# Altium schematic sheet STM32F446RE_board.SchDoc: RP2040 CNC
size C; Author: AM; CompanyName: Expatria Technologies; DrawnBy: A.Marles; Engineer: AM; Organization: Expatria Technolgoies; Address1: Schematic; DocumentNumber: 2; SheetNumber: 2; SheetTotal: 14
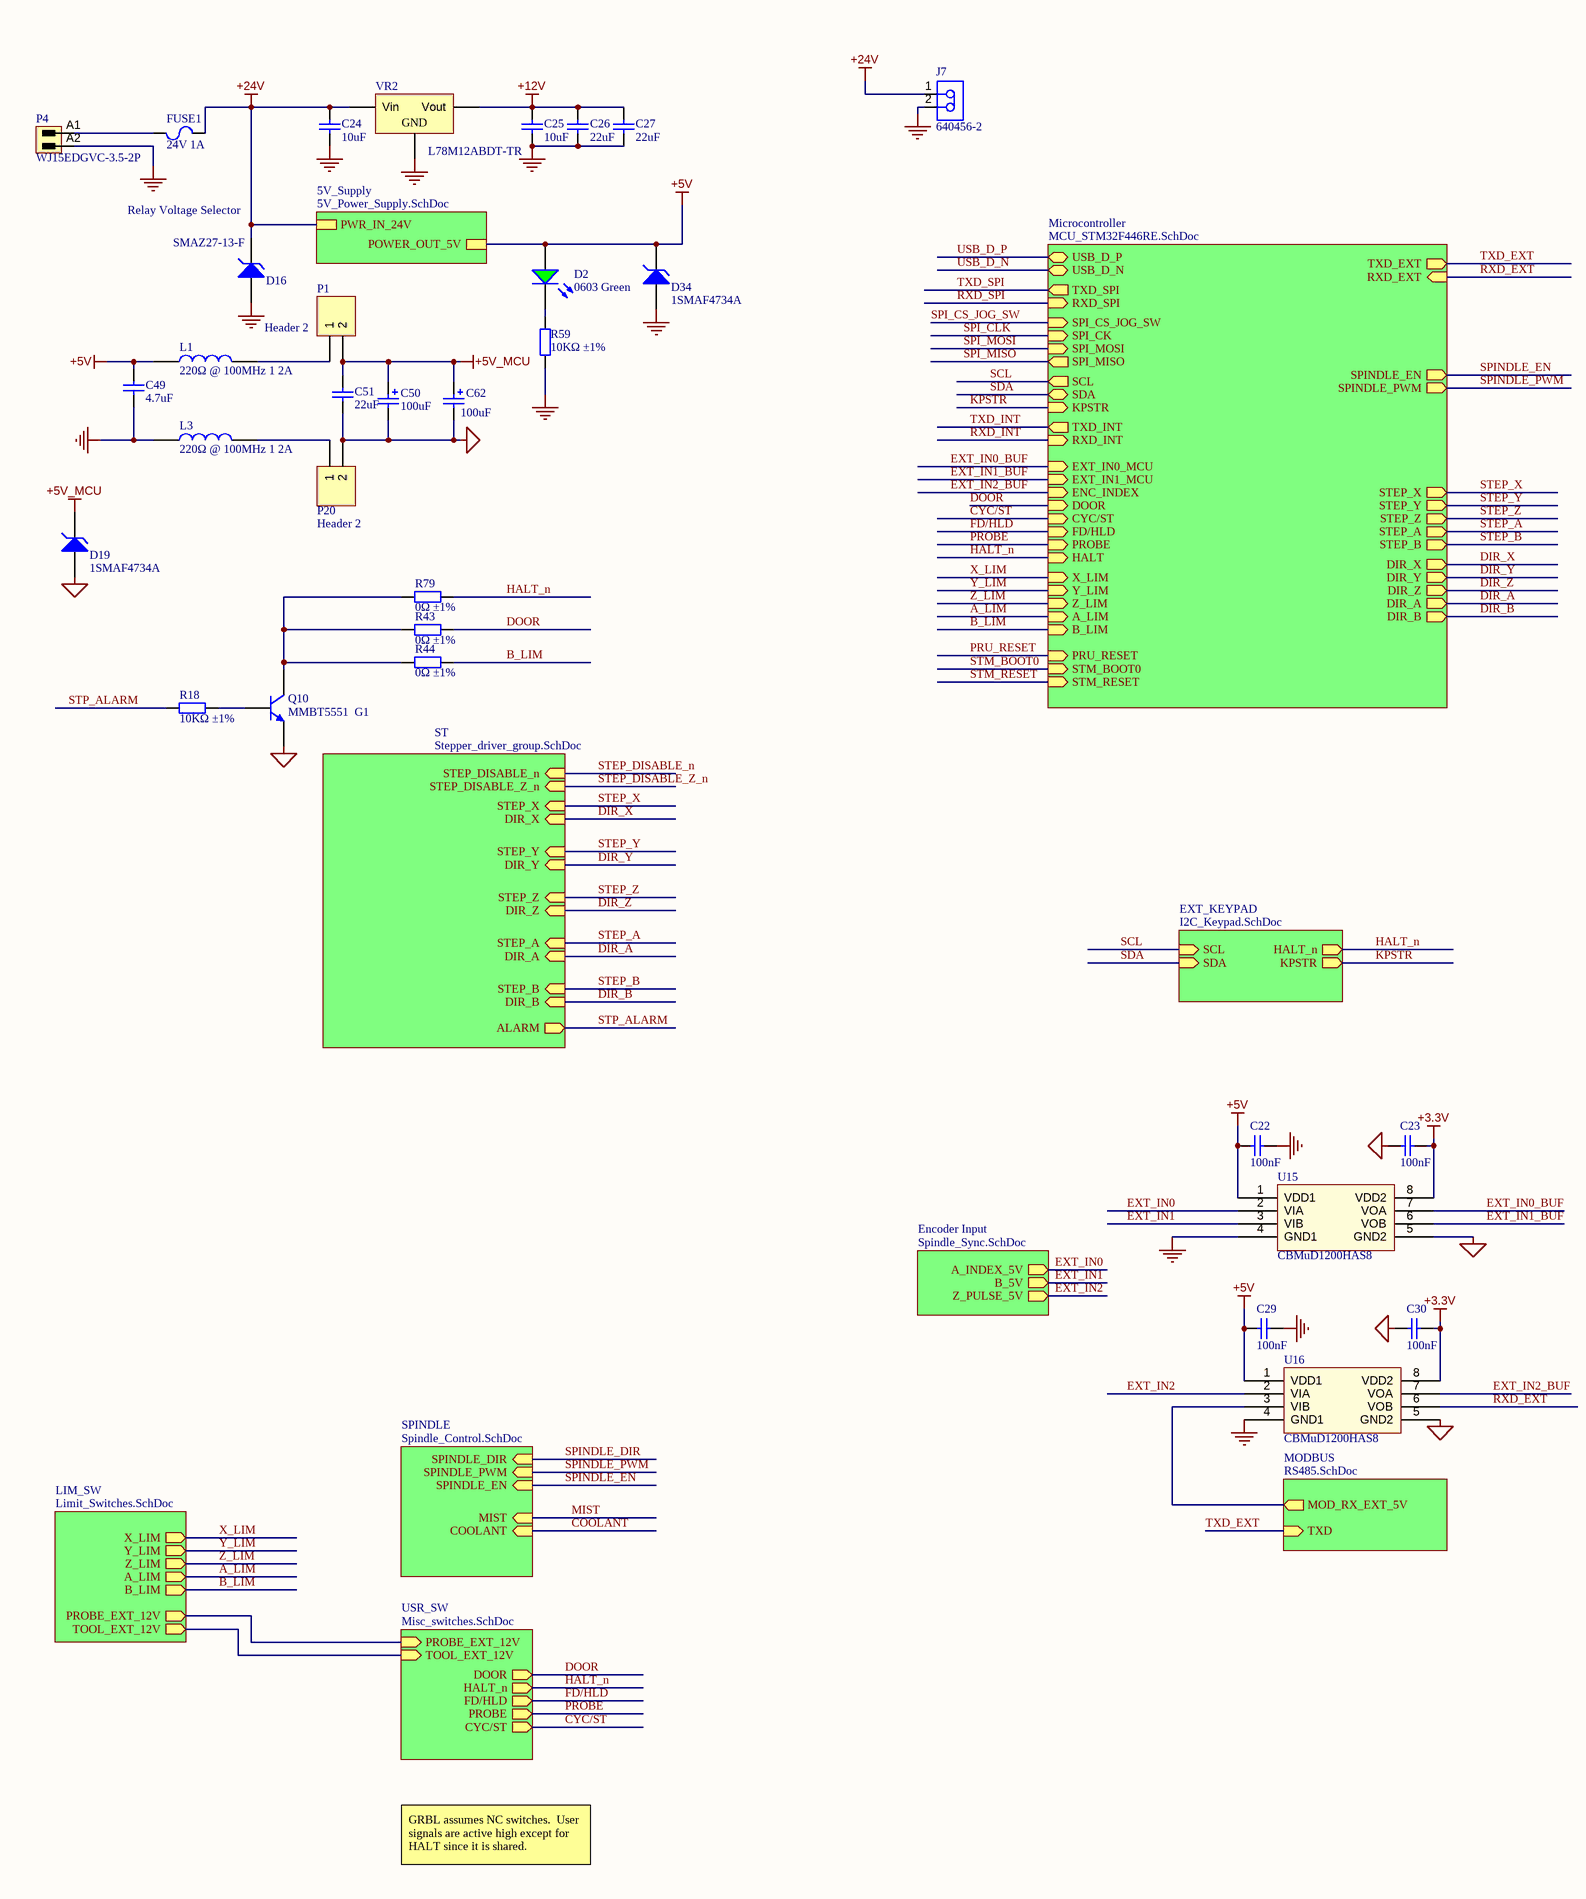
[diagram p0: STM32F446RE_board.SchDoc, left]
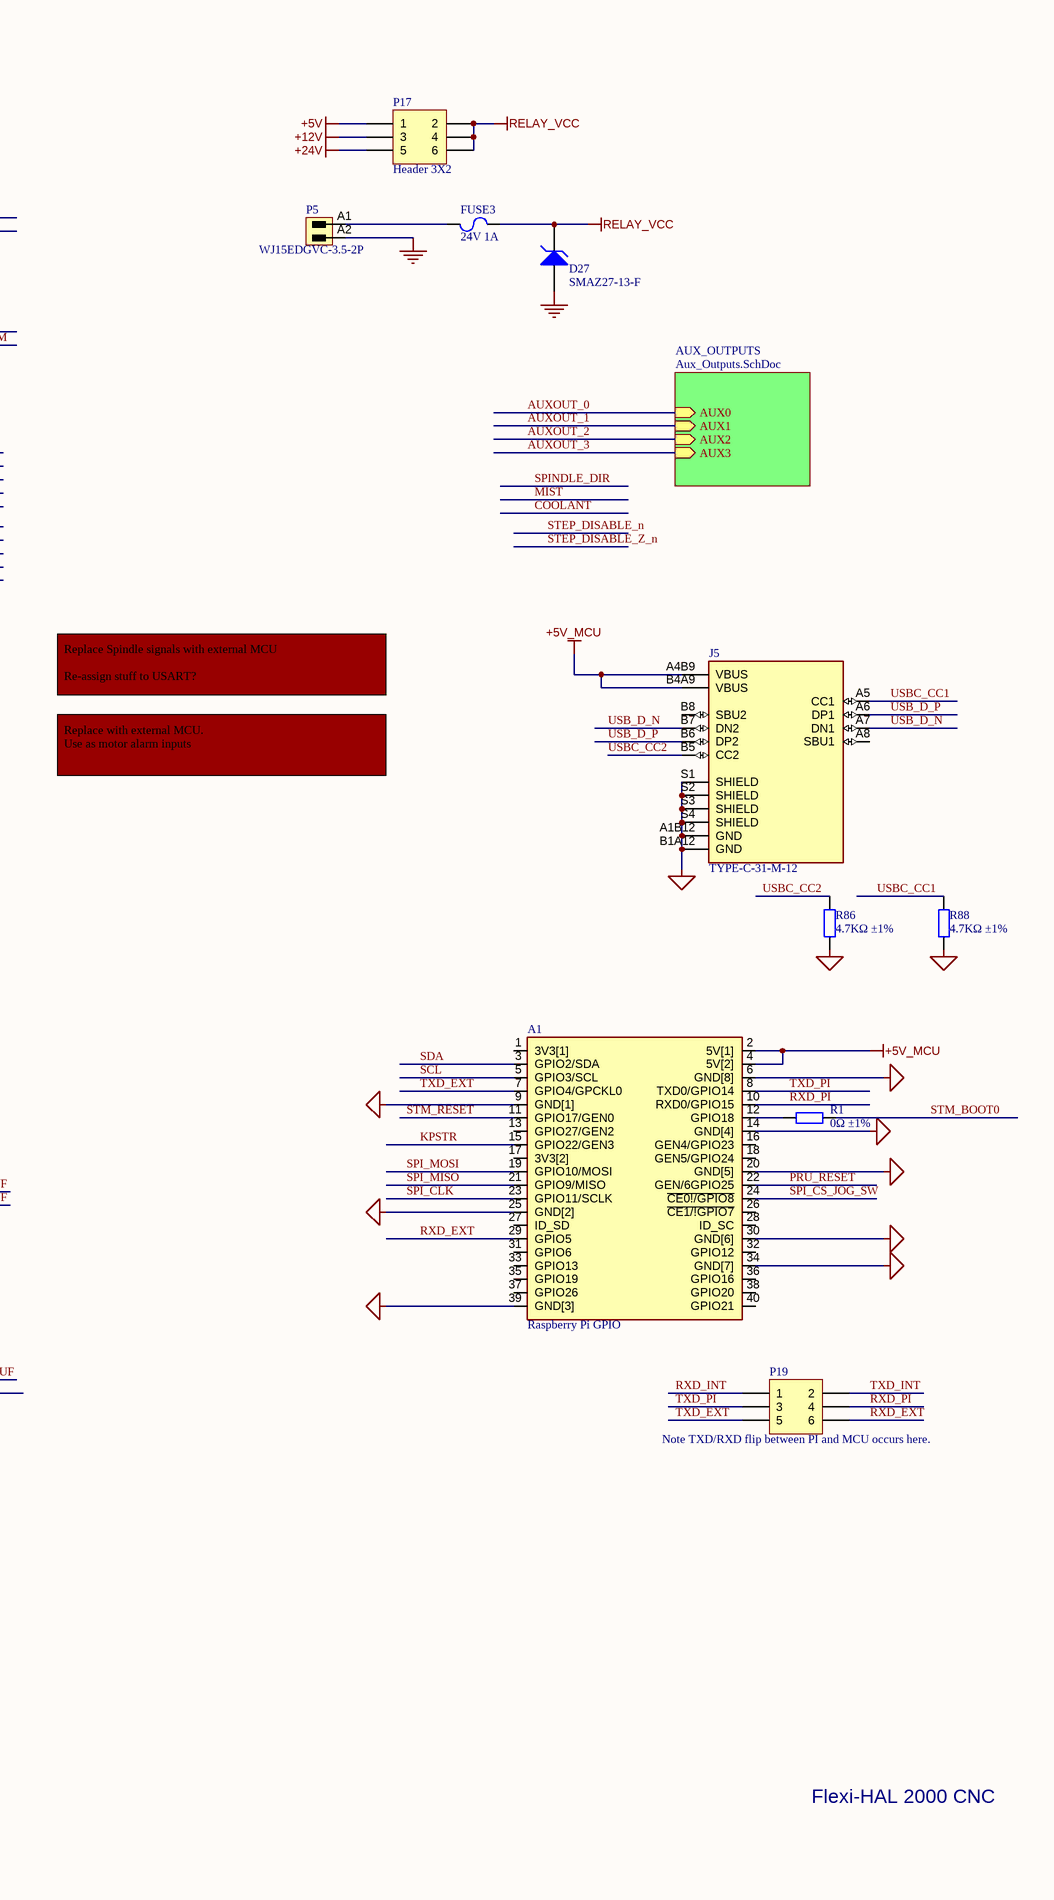
[diagram p1: STM32F446RE_board.SchDoc, right]

## Parts
A1  Raspberry Pi GPIO  [MODULE_RASPBERRY_PI_4_MODEL_B]
C22  100nF  [0603_C]
C23  100nF  [0603_C]
C24  10uF  [1206_C]
C25  10uF  [1206_C]
C26  22uF  [0805_C]
C27  22uF  [0805_C]
C29  100nF  [0603_C]
C30  100nF  [0603_C]
C49  4.7uF  [0603_C]
C50  100uF  [CASE-B_3528]
C51  22uF  [0805_C]
C62  100uF  [WCAP-ASLI_D6.3H7.7]
D2  0603 Green  [0603_LED_S1]
D16  SMAZ27-13-F  [DIOM5226X240N]
D19  1SMAF4734A  [DIOM5226X240N]
D27  SMAZ27-13-F  [DIOM5226X240N]
D34  1SMAF4734A  [DIOM5226X240N]
FUSE1  24V 1A  [1206_C]
FUSE3  24V 1A  [1206_C]
J5  TYPE-C-31-M-12  [HRO_TYPE-C-31-M-12]
J7  640456-2  [TECO-640456-2_V]
L1  220Ω @ 100MHz 1 2A  [0805_C]
L3  220Ω @ 100MHz 1 2A  [0805_C]
P1  Header 2  [HDR1X2]
P4  WJ15EDGVC-3.5-2P  [691321100002]
P5  WJ15EDGVC-3.5-2P  [691321100002]
P17  Header 3X2  [HDR2X3]
P19  Header 3X2  [HDR2X3]  (value not drawn)
P20  Header 2  [HDR1X2]
Q10  MMBT5551  G1  [SOT-23(SOT-23-3)]
R1  0Ω ±1%  [0603_R]
R18  10KΩ ±1%  [0603_R]
R43  0Ω ±1%  [0603_R]
R44  0Ω ±1%  [0603_R]
R59  10KΩ ±1%  [0603_R]
R79  0Ω ±1%  [0603_R]
R86  4.7KΩ ±1%  [0603_R]
R88  4.7KΩ ±1%  [0603_R]
U15  CBMuD1200HAS8  [SOIC-8_150mil]
U16  CBMuD1200HAS8  [SOIC-8_150mil]
VR2  L78M12ABDT-TR  [TO-252-2-180]

## Sub-sheets
5V_Supply = 5V_Power_Supply.SchDoc: POWER_OUT_5V, PWR_IN_24V
AUX_OUTPUTS = Aux_Outputs.SchDoc: AUX3 (in), AUX0 (in), AUX1 (in), AUX2 (in)
Encoder Input = Spindle_Sync.SchDoc: A_INDEX_5V (out), Z_PULSE_5V (out), B_5V (out)
EXT_KEYPAD = I2C_Keypad.SchDoc: HALT_n (out), SCL (in), KPSTR (out), SDA (in)
LIM_SW = Limit_Switches.SchDoc: Y_LIM (out), Z_LIM (out), X_LIM (out), A_LIM (out), B_LIM (out), PROBE_EXT_12V (out), TOOL_EXT_12V (out)
Microcontroller = MCU_STM32F446RE.SchDoc: USB_D_P (bidir), DIR_B (out), EXT_IN1_MCU (in), RXD_INT (in), DIR_Y (out), EXT_IN0_MCU (in), USB_D_N (bidir), DIR_X (out), STEP_B (out), TXD_INT (out), STEP_A (out), SPI_CK (in), SPINDLE_PWM (out), STEP_Z (out), STEP_Y (out), SPI_MISO (out), SPI_MOSI (in), FD/HLD (in), STEP_X (out), CYC/ST (in), SPI_CS_JOG_SW (in), PROBE (in), TXD_EXT (out), SDA (bidir), A_LIM (in), SCL (out), DIR_Z (out), KPSTR (in), RXD_EXT (in), SPINDLE_EN (out), HALT (in), DIR_A (out), PRU_RESET (in), X_LIM (in), Z_LIM (in), STM_BOOT0 (in), Y_LIM (in), B_LIM (in), DOOR (in), STM_RESET (in), TXD_SPI (out), ENC_INDEX (in), RXD_SPI (in)
MODBUS = RS485.SchDoc: TXD (in), MOD_RX_EXT_5V (out)
SPINDLE = Spindle_Control.SchDoc: SPINDLE_EN (in), SPINDLE_DIR (in), SPINDLE_PWM (in), COOLANT (in), MIST (in)
ST = Stepper_driver_group.SchDoc: STEP_Z (in), DIR_Z (in), STEP_X (in), STEP_B (in), DIR_X (in), DIR_A (in), DIR_Y (in), STEP_Y (in), DIR_B (in), STEP_A (in), ALARM (out), STEP_DISABLE_n (in), STEP_DISABLE_Z_n (in)
USR_SW = Misc_switches.SchDoc: FD/HLD (out), PROBE (out), CYC/ST (out), HALT_n (out), DOOR (out), PROBE_EXT_12V (in), TOOL_EXT_12V (in)

## Nets
+3.3V: C23.2 C30.2 U15.8(VDD2) U16.8(VDD2)
+5V: C22.1 C29.1 C49.2 D2.A D34.2(K) L1.1 P17.1 U15.1(VDD1) U16.1(VDD1) ; sheet 5V_Supply/POWER_OUT_5V
+5V_MCU: A1.2(5V[1]) A1.4(5V[2]) C50.1 C51.2 C62.1(P) D19.2(K) J5.A4B9(VBUS) J5.B4A9(VBUS) P1.2
+12V: C25.2 C26.2 C27.2 P17.3 VR2.3(Vout)
+24V: C24.2 D16.2(K) FUSE1.2 J7.1 P17.5 VR2.1(Vin) ; sheet 5V_Supply/PWR_IN_24V
GND: C22.2 C24.1 C25.1 C26.1 C27.1 C29.2 C49.1 D16.1(A) D27.1(A) D34.1(A) J7.2 L3.1 P4.A2 P5.A2 R59.1 U15.4(GND1) U16.4(GND1) VR2.2(GND)
MCU_GND: A1.6(GND[8]) A1.9(GND[1]) A1.14(GND[4]) A1.20(GND[5]) A1.25(GND[2]) A1.30(GND[6]) A1.34(GND[7]) A1.39(GND[3]) C23.1 C30.1 C50.2 C51.1 C62.2(N) D19.1(A) J5.A1B12(GND) J5.B1A12(GND) J5.S1(SHIELD) J5.S2(SHIELD) J5.S3(SHIELD) J5.S4(SHIELD) P20.2 Q10.2(E) R86.2 R88.2 U15.5(GND2) U16.5(GND2)
RELAY_VCC: D27.2(K) FUSE3.2 P17.2 P17.4 P17.6
A_LIM: sheet LIM_SW/A_LIM, sheet Microcontroller/A_LIM
AUXOUT_0: sheet AUX_OUTPUTS/AUX0
AUXOUT_1: sheet AUX_OUTPUTS/AUX1
AUXOUT_2: sheet AUX_OUTPUTS/AUX2
AUXOUT_3: sheet AUX_OUTPUTS/AUX3
B_LIM: R44.1 ; sheet LIM_SW/B_LIM, sheet Microcontroller/B_LIM
COOLANT: sheet SPINDLE/COOLANT
CYC/ST: sheet USR_SW/CYC/ST, sheet Microcontroller/CYC/ST
DIR_A: sheet ST/DIR_A, sheet Microcontroller/DIR_A
DIR_B: sheet ST/DIR_B, sheet Microcontroller/DIR_B
DIR_X: sheet ST/DIR_X, sheet Microcontroller/DIR_X
DIR_Y: sheet ST/DIR_Y, sheet Microcontroller/DIR_Y
DIR_Z: sheet ST/DIR_Z, sheet Microcontroller/DIR_Z
DOOR: R43.1 ; sheet USR_SW/DOOR, sheet Microcontroller/DOOR
EXT_IN0: U15.2(VIA) ; sheet Encoder Input/A_INDEX_5V
EXT_IN0_BUF: U15.7(VOA) ; sheet Microcontroller/EXT_IN0_MCU
EXT_IN1: U15.3(VIB) ; sheet Encoder Input/B_5V
EXT_IN1_BUF: U15.6(VOB) ; sheet Microcontroller/EXT_IN1_MCU
EXT_IN2: U16.2(VIA) ; sheet Encoder Input/Z_PULSE_5V
EXT_IN2_BUF: U16.7(VOA) ; sheet Microcontroller/ENC_INDEX
FD/HLD: sheet USR_SW/FD/HLD, sheet Microcontroller/FD/HLD
HALT_n: R79.1 ; sheet USR_SW/HALT_n, sheet EXT_KEYPAD/HALT_n, sheet Microcontroller/HALT
KPSTR: A1.15(GPIO22/GEN3) ; sheet EXT_KEYPAD/KPSTR, sheet Microcontroller/KPSTR
MIST: sheet SPINDLE/MIST
PROBE: sheet USR_SW/PROBE, sheet Microcontroller/PROBE
PRU_RESET: A1.22(GEN/6GPIO25) ; sheet Microcontroller/PRU_RESET
RXD_EXT: A1.29(GPIO5) P19.6 U16.6(VOB) ; sheet Microcontroller/RXD_EXT
RXD_INT: P19.1 ; sheet Microcontroller/RXD_INT
RXD_PI: A1.10(RXD0/GPIO15) P19.4
RXD_SPI: sheet Microcontroller/RXD_SPI
SCL: A1.5(GPIO3/SCL) ; sheet EXT_KEYPAD/SCL, sheet Microcontroller/SCL
SDA: A1.3(GPIO2/SDA) ; sheet EXT_KEYPAD/SDA, sheet Microcontroller/SDA
SPI_CLK: A1.23(GPIO11/SCLK) ; sheet Microcontroller/SPI_CK
SPI_CS_JOG_SW: A1.24(~{CE0!/GPIO8}) ; sheet Microcontroller/SPI_CS_JOG_SW
SPI_MISO: A1.21(GPIO9/MISO) ; sheet Microcontroller/SPI_MISO
SPI_MOSI: A1.19(GPIO10/MOSI) ; sheet Microcontroller/SPI_MOSI
SPINDLE_DIR: sheet SPINDLE/SPINDLE_DIR
SPINDLE_EN: sheet SPINDLE/SPINDLE_EN, sheet Microcontroller/SPINDLE_EN
SPINDLE_PWM: sheet SPINDLE/SPINDLE_PWM, sheet Microcontroller/SPINDLE_PWM
STEP_A: sheet ST/STEP_A, sheet Microcontroller/STEP_A
STEP_B: sheet ST/STEP_B, sheet Microcontroller/STEP_B
STEP_DISABLE_n: sheet ST/STEP_DISABLE_n
STEP_DISABLE_Z_n: sheet ST/STEP_DISABLE_Z_n
STEP_X: sheet ST/STEP_X, sheet Microcontroller/STEP_X
STEP_Y: sheet ST/STEP_Y, sheet Microcontroller/STEP_Y
STEP_Z: sheet ST/STEP_Z, sheet Microcontroller/STEP_Z
STM_BOOT0: R1.1 ; sheet Microcontroller/STM_BOOT0
STM_RESET: A1.11(GPIO17/GEN0) ; sheet Microcontroller/STM_RESET
STP_ALARM: R18.2 ; sheet ST/ALARM
TXD_EXT: A1.7(GPIO4/GPCKL0) P19.5 ; sheet MODBUS/TXD, sheet Microcontroller/TXD_EXT
TXD_INT: P19.2 ; sheet Microcontroller/TXD_INT
TXD_PI: A1.8(TXD0/GPIO14) P19.3
TXD_SPI: sheet Microcontroller/TXD_SPI
USB_D_N: J5.A7(DN1) J5.B7(DN2) ; sheet Microcontroller/USB_D_N
USB_D_P: J5.A6(DP1) J5.B6(DP2) ; sheet Microcontroller/USB_D_P
USBC_CC1: J5.A5(CC1) R88.1
USBC_CC2: J5.B5(CC2) R86.1
X_LIM: sheet LIM_SW/X_LIM, sheet Microcontroller/X_LIM
Y_LIM: sheet LIM_SW/Y_LIM, sheet Microcontroller/Y_LIM
Z_LIM: sheet LIM_SW/Z_LIM, sheet Microcontroller/Z_LIM
NetA1_12: A1.12(GPIO18) R1.2
NetD2_K: D2.K R59.2
NetFUSE1_1: FUSE1.1 P4.A1
NetFUSE3_1: FUSE3.1 P5.A1
NetL1_2: L1.2 P1.1
NetL3_2: L3.2 P20.1
NetQ10_1: Q10.1(B) R18.1
NetQ10_3: Q10.3(C) R43.2 R44.2 R79.2
NetU16_3: U16.3(VIB) ; sheet MODBUS/MOD_RX_EXT_5V
(unnamed): sheet LIM_SW/PROBE_EXT_12V, sheet USR_SW/PROBE_EXT_12V
(unnamed): sheet LIM_SW/TOOL_EXT_12V, sheet USR_SW/TOOL_EXT_12V

Not connected (* = marked no-connect by the designer): A1 1(3V3[1]) 13(GPIO27/GEN2) 16(GEN4/GPIO23) 17(3V3[2]) 18(GEN5/GPIO24) 26(~{CE1/!GPIO7}) 27(ID_SD) 28(ID_SC) 31(GPIO6) 32(GPIO12) 33(GPIO13) 35(GPIO19) 36(GPIO16) 37(GPIO26) 38(GPIO20) 40(GPIO21); J5 A8(SBU1) B8(SBU2)

## Notes on the sheet
- Relay Voltage Selector
- Replace Spindle signals with external MCU
  Re-assign stuff to USART?
- Replace with external MCU.
  Use as motor alarm inputs
- (near P19) Note TXD/RXD flip between PI and MCU occurs here.
- Flexi-HAL 2000 CNC
- GRBL assumes NC switches.  User signals are active high except for HALT since it is shared.
- Expatria Technologies
- SHEET
- PROJECT
- REV
- 1136 Glade Court
- Port Coquitlam, BC V3B 1R5
- EMAIL: INFO@EXPATRIA.CA
- SIZE
- ENGR
- C
- MODIFIED
- DOCUMENT
- /
- Copyright Expatria Technologies 2022. This document describes Open Hardware and is licensed under the CERN-OHL-S v2. No warranty is implied or expressed.

## Library data of the parts
A1 = ADA3708: Raspberry Pi Zero WH _Zero W with Headers_; MP: DS1023-2*20SF11; MF: CONNFLY Elec; Availability: Unavailable; Package: None; Value: *; Price: None; SuppliersPartNumber: C132132
C22 C23 C29 C30 = 0603 100nF (104) 10% 50V: Chip capacitors; Manufacturer: YAGEO; PartNumber: CC0603KRX7R9BB104; Tolerance: 10%; Voltage: 50V; ComponentLink1Description: Supplier link; ComponentLink1URL: http://www.szlcsc.com/product/details_15331.html; Package: 0603; Supplier: LC; SuppliersPartNumber: C14663; Capacitance: 100nF
C24 C25 = 1206 10uF (106) 10% 50V: Chip capacitors; Manufacturer: Samsung Electro-Mechanics; PartNumber: CL31A106KBHNNNE; Tolerance: 10%; Voltage: 50V; ComponentLink1Description: Supplier link; ComponentLink1URL: http://www.szlcsc.com/product/details_14236.html; Package: 1206; Supplier: LC; SuppliersPartNumber: C13585; Capacitance: 10uF
C26 C27 C51 = 0805 22uF (226) 20% 25V: Chip capacitors; Manufacturer: Samsung Electro-Mechanics; PartNumber: CL21A226MAQNNNE; Tolerance: 20%; Voltage: 25V; ComponentLink1Description: Supplier link; ComponentLink1URL: http://www.szlcsc.com/product/details_46786.html; Package: 0805; Supplier: LC; SuppliersPartNumber: C2922481; Capacitance: 22uF
C49 = 0603 4.7uF (475) 10% 16V: Chip capacitors; Manufacturer: Samsung Electro-Mechanics; PartNumber: CL10A475KO8NNNC; Tolerance: 10%; Voltage: 16V; ComponentLink1Description: Supplier link; ComponentLink1URL: http://www.szlcsc.com/product/details_20375.html; Package: 0603; Supplier: LC; SuppliersPartNumber: C19666; Capacitance: 4.7uF
C50 = 3528 100uF (107) 10% 6.3V: Tantalum capacitor; Manufacturer: AVX; PartNumber: TAJB107K006RNJ; Tolerance: 10%; Voltage: 6.3V; ComponentLink1Description: Supplier link; ComponentLink1URL: http://www.szlcsc.com/product/details_16815.html; Package: 3528; Supplier: LC; SuppliersPartNumber: C16133; Capacitance: 100uF
C62 = 865080445010: -45℃~+105℃ 2000hrs@105℃ 100uF 7.7mm 35V 6.3mm ±20% SMD,6.3x7.7mm Aluminum Electrolytic Capacitors - SMD ROHS; Manufacturer: Capxon International Elec; SuppliersPartNumber: C59934; Value: 100uF
D2 = 0603 LED Green: LED; ComponentLink1Description: 供应商链接; ComponentLink1URL: http://www.szlcsc.com/product/details_73152.html; Package: 0603; Supplier: LC; SuppliersPartNumber: C72043; Color: Green
D16 D19 D27 D34 = BZT52C27: 27V ±5% 1W 500nA @ 20.5V SMA(DO-214AC) Zener Diodes RoHS; ComponentLink1Description: 供应商链接; ComponentLink1URL: http://www.szlcsc.com/product/details_8541.html; Supplier: LC
  D16 D27: Package: SMA(DO-214AC); SuppliersPartNumber: C155318
  D19 D34: Package: SMAF; SuppliersPartNumber: C169539
FUSE1 FUSE3 = JK-nSMD050-24: 24V 1A 0.1s 1206 PTC Resettable Fuses RoHS; Manufacturer: Jinrui Electronic Materials Co.; Package: 1206; Supplier: LC; SuppliersPartNumber: C369160; PartNumber: JK-nSMD050-24
J5 = TYPE-C-31-M-12: USB Connectors 24 Receptacle 1 8.94*7.3mm RoHS; MF: HRO Electronics Co., Ltd.; Value: *; SnapEDA_Link: https://www.snapeda.com/parts/TYPE-C-31-M-12/HRO%20Electronics%20Co.,%20Ltd./view-part/3228496/?ref=snap; Package: Package; MP: TYPE-C-31-M-12; Price: None; Availability: Unavailable; SuppliersPartNumber: C2765186
J7 = CMP-2000-05417-1: Male Header, Pitch 2.54 mm, 1 x 2 Position, Height 10.49 mm, Tail Length 3.556 mm, -55 to 105 degC, RoHS, Bulk; Manufacturer: TE Connectivity; Standards: RoHSCompliant,ELVCompliant,UL94V-0; Material, Housing: Polyester; Agency Approvals: CSA,UL; Brand/Series: MTA-100Series; Contact Centerline Spacing: 0.100 / in.; Material, Contact: CopperAlloy; Current, Rating: 5 / A; Color, Housing: White; Contact Termination Area Plating: Tin; Special Features: Pinstrip; Number of Positions: 2; Pin Spacing: 0.1 / "; Temperature, Operating: -55to+105 / degC; Angle: Straight; Mount Angle: Vertical; Connector Type: MTA-100; Primary Type: InterconnectSystem; Voltage, Rating: 250 / V; Mounting Hole Size: 0.04 / "; Number of Rows: 1; Termination: Solder; Length, Terminal Post: 0.14 / in.; Manufacturer URL: http://www.te.com/; Color: White; Size, Post: 0.025 / in.; Contact Shape: Square; Mounting Type: PCMount; Datasheet URL: https://datasheet.ciiva.com/11746/0900766b80eb7fdd-11746365.pdf; Type: PCBPlug; Datasheet Version: Rev. W, 06/2004; Number of Contacts: 2; Flammability Rating: UL94V-0; Contact Plating: Tin; Length, Pin: 0.14 / "; Contact Mating Area Plating: Tin; Length, Overall: 0.2 / "; SuppliersPartNumber: C86502
L1 L3 = 0402 220R@100Mhz 0.1A: 220Ω @ 100MHz 1 2A 150mΩ 0805 Ferrite Beads ROHS; Notepad: *; Package: 0805; Supplier: LC; SuppliersPartNumber: C139188
P1 P20 = Header 2: Header, 2-Pin; Publisher: Altium Limited; LatestRevisionDate: 17-Jul-2002; LatestRevisionNote: Re-released for DXP Platform.; SuppliersPartNumber: C234182
P4 = 3.5mm Terminal Header 2p: Header,Male Pin,Covered(4 Sided) 2 1 0.138"（3.50mm） 2 P=3.5mm Pluggable System Terminal Block RoHS; UL_94_flammability_rating: V-0; Pitch_mm: 3.5 mm; ComponentLink1Description: Manufacturer URL; ComponentLink1URL: http://www.weidmueller.com/; Revision: V1; SuppliersPartNumber: C192777; Supplier: LCSC
P5 = 3.5mm Terminal Header 2p: Header,Male Pin,Covered(4 Sided) 2 1 0.138"（3.50mm） 2 P=3.5mm Pluggable System Terminal Block RoHS; Manufacturer: Weidmueller; Manufacturer 1: Weidmuller; Manufacturer Part Number 1: 1604470000; UL_94_flammability_rating: V-0; Pitch_mm: 3.5 mm; Side_termination_characteristic: closed side; Pitch_inch: 0.138 inch; Solder_pin_length_mm: 3.2 mm; Short_text_for_material: SL 3.50/02/180G 3.2SN OR BX; ComponentLink1Description: Manufacturer URL; ComponentLink1URL: http://www.weidmueller.com/; PartNumber: WJ15EDGVC-3.5-2P; Revision: V1; PackageReference: SL_3_50_180G_02; Packaging: Box; SuppliersPartNumber: C192777
P17 P19 = Header 3X2: Header, 3-Pin, Dual row; Publisher: Altium Limited; SuppliersPartNumber: C65114
Q10 = SOT-23 MMBT5551  G1: 三极管; ComponentLink1Description: 供应商链接; ComponentLink1URL: http://www.szlcsc.com/product/details_2502.html; Package: SOT-23; Supplier: LC; SuppliersPartNumber: C2145
R1 R43 R44 R79 = 0603 0R (0R0) 1%: Chip resistor; Manufacturer: Uniroyal Elec; PartNumber: 0603WAF0000T5E; Power: 1/10W; ComponentLink1Description: Supplier link; ComponentLink1URL: http://www.szlcsc.com/product/details_21903.html; Package: 0603; Supplier: LC; SuppliersPartNumber: C21189; Resistance: 0Ω; Tolerance: 1%
R18 R59 = 0603 10K (1002) 1%: Chip resistor; Manufacturer: Uniroyal Elec; PartNumber: 0603WAF1002T5E; Power: 1/10W; ComponentLink1Description: Supplier link; ComponentLink1URL: http://www.szlcsc.com/product/details_26547.html; Package: 0603; Supplier: LC; SuppliersPartNumber: C25804; Resistance: 10KΩ; Tolerance: 1%
R86 R88 = 0603 4.7K (4701) 1%: Chip resistor; Manufacturer: Uniroyal Elec; PartNumber: 0603WAF4701T5E; Power: 1/10W; ComponentLink1Description: Supplier link; ComponentLink1URL: http://www.szlcsc.com/product/details_23889.html; Package: 0603; Supplier: LC; SuppliersPartNumber: C23162; Resistance: 4.7KΩ; Tolerance: 1%
U15 U16 = ADUM1201ARZ-RL7_[C9669]: Dual Channel Isolator; Package: SOIC-8_150mil; Supplier: LC; SuppliersPartNumber: C476471
VR2 = TO-252-2 L78M05ABDT-TR: 500mA 55dB@(120Hz) Fixed 12V~12V Positive 1 35V TO-252-2(DPAK) Linear Voltage Regulators (LDO) ROHS; ComponentLink1Description: 供应商链接; ComponentLink1URL: http://www.szlcsc.com/product/details_59107.html; Package: TO-252-2; Supplier: digikey; SuppliersPartNumber: C16424